# EAGLE design ERA-3SM (EAGLE 6.5.0)
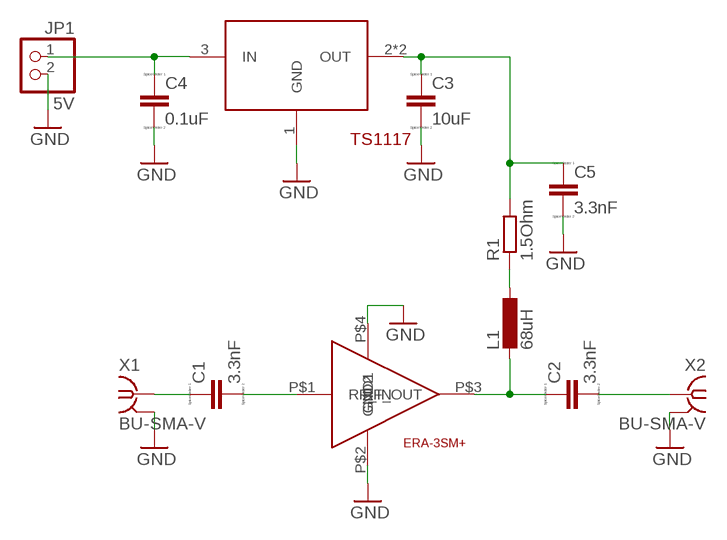
[diagram p0: schematic, sheet 1]

## Parts
C1  3.3nF  C_SMD  [C0805]
C2  3.3nF  C_SMD  [C0805]
C3  10uF  C_SMD  [C0805]
C4  0.1uF  C_SMD  [C0805]
C5  3.3nF  C_SMD  [C0805]
JP1  5V  PINHD-1X2  [1X02]
L1  68uH  L-EU  [1616FPS]
R1  1.5Ohm  R-EU_R0805  [R0805]
U$1  ERA-3SM+  [WW107]
U$2  TS1117  [SOT223]
X1  BU-SMA-V  [BU-SMA-V]
X2  BU-SMA-V  [BU-SMA-V]

## Nets
GND: C3.2 C4.2 C5.2 JP1.2 U$1.P$2(GND1) U$1.P$4(GND2) U$2.1(GND) X1.2 X1.3 X1.4 X1.5 X2.2 X2.3 X2.4 X2.5
N$1: C1.1 X1.1
N$2: C1.2 U$1.P$1(RF_IN)
N$3: C2.1 L1.P$2 U$1.P$3(RF_OUT)
N$4: C2.2 X2.1
N$5: L1.P$1 R1.1
N$6: C3.1 C5.1 R1.2 U$2.2(OUT) U$2.4(OUT)
N$7: C4.1 JP1.1 U$2.3(IN)

## Library data of the parts
C1-C5 = 0myLib:C_SMD: CAPACITOR, European symbol; SPICEMODEL: NONE; SPICEPREFIX: C
JP1 = 0myLib:PINHD-1X2: PIN HEADER
L1 = 0myLib:L-EU: INDUCTOR, European symbol
R1 = 0myLib:R-EU_: RESISTOR, European symbol
U$1 = 0myLib:ERA-3SM+
U$2 = 0myLib:TS1117
X1 X2 = 0myLib:BU-SMA-V: FEMALE SMA CONNECTOR Radiall distributor RS 112-3794; OC_FARNELL: unknown; OC_NEWARK: unknown

## Board
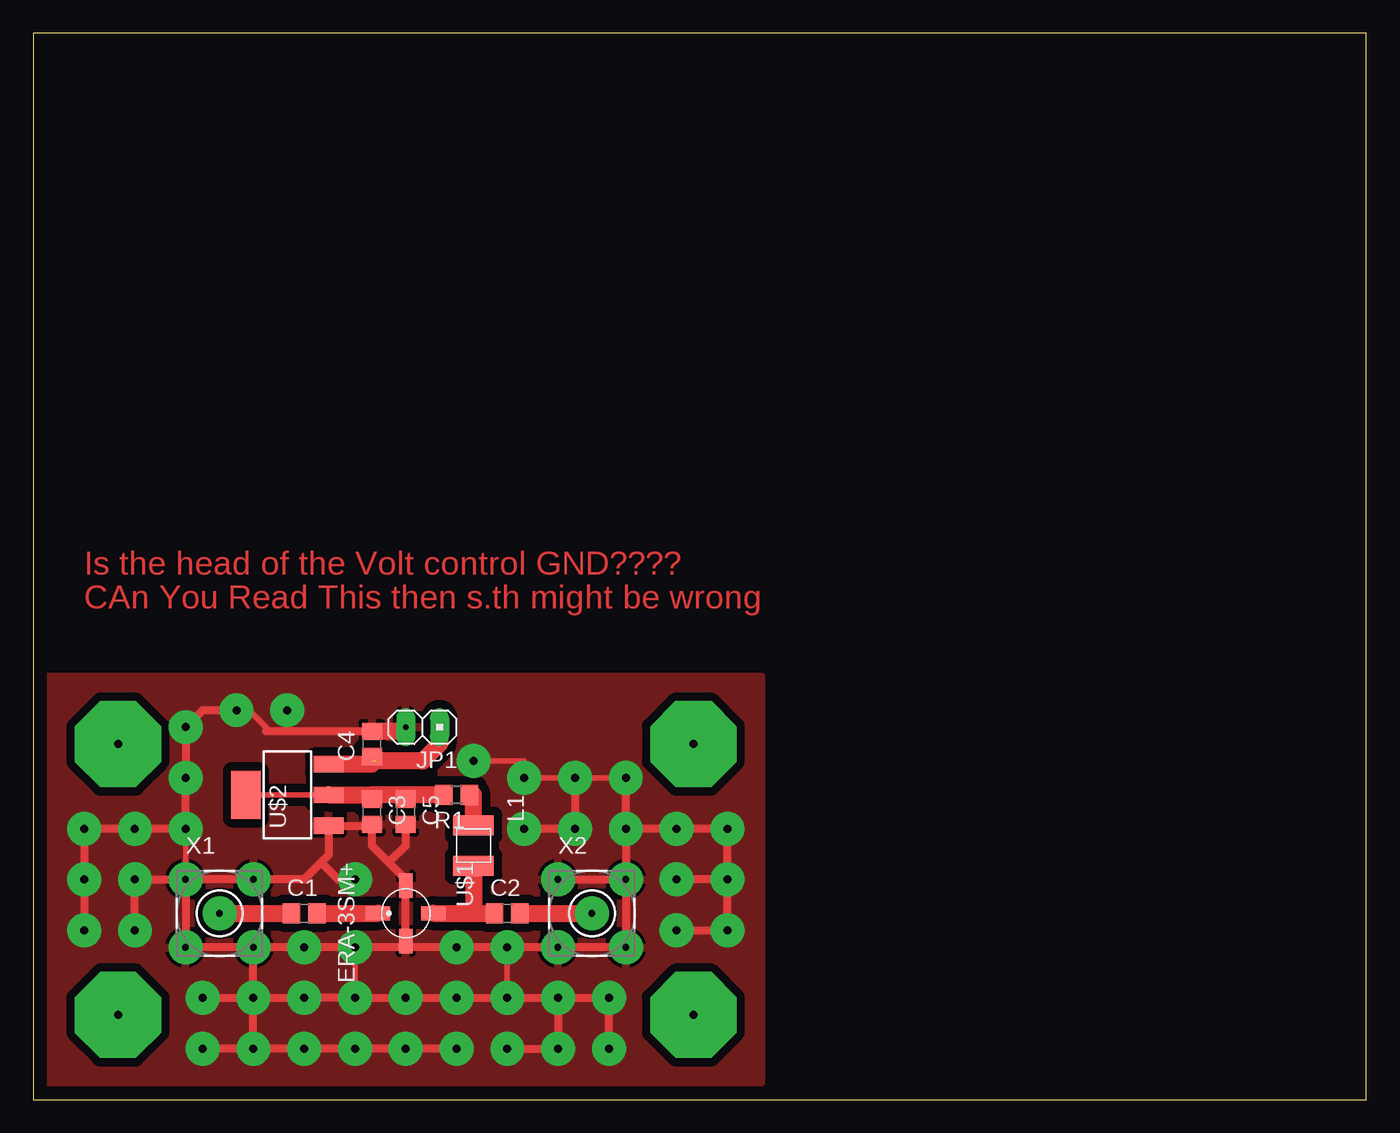
[diagram p1: board, top side]
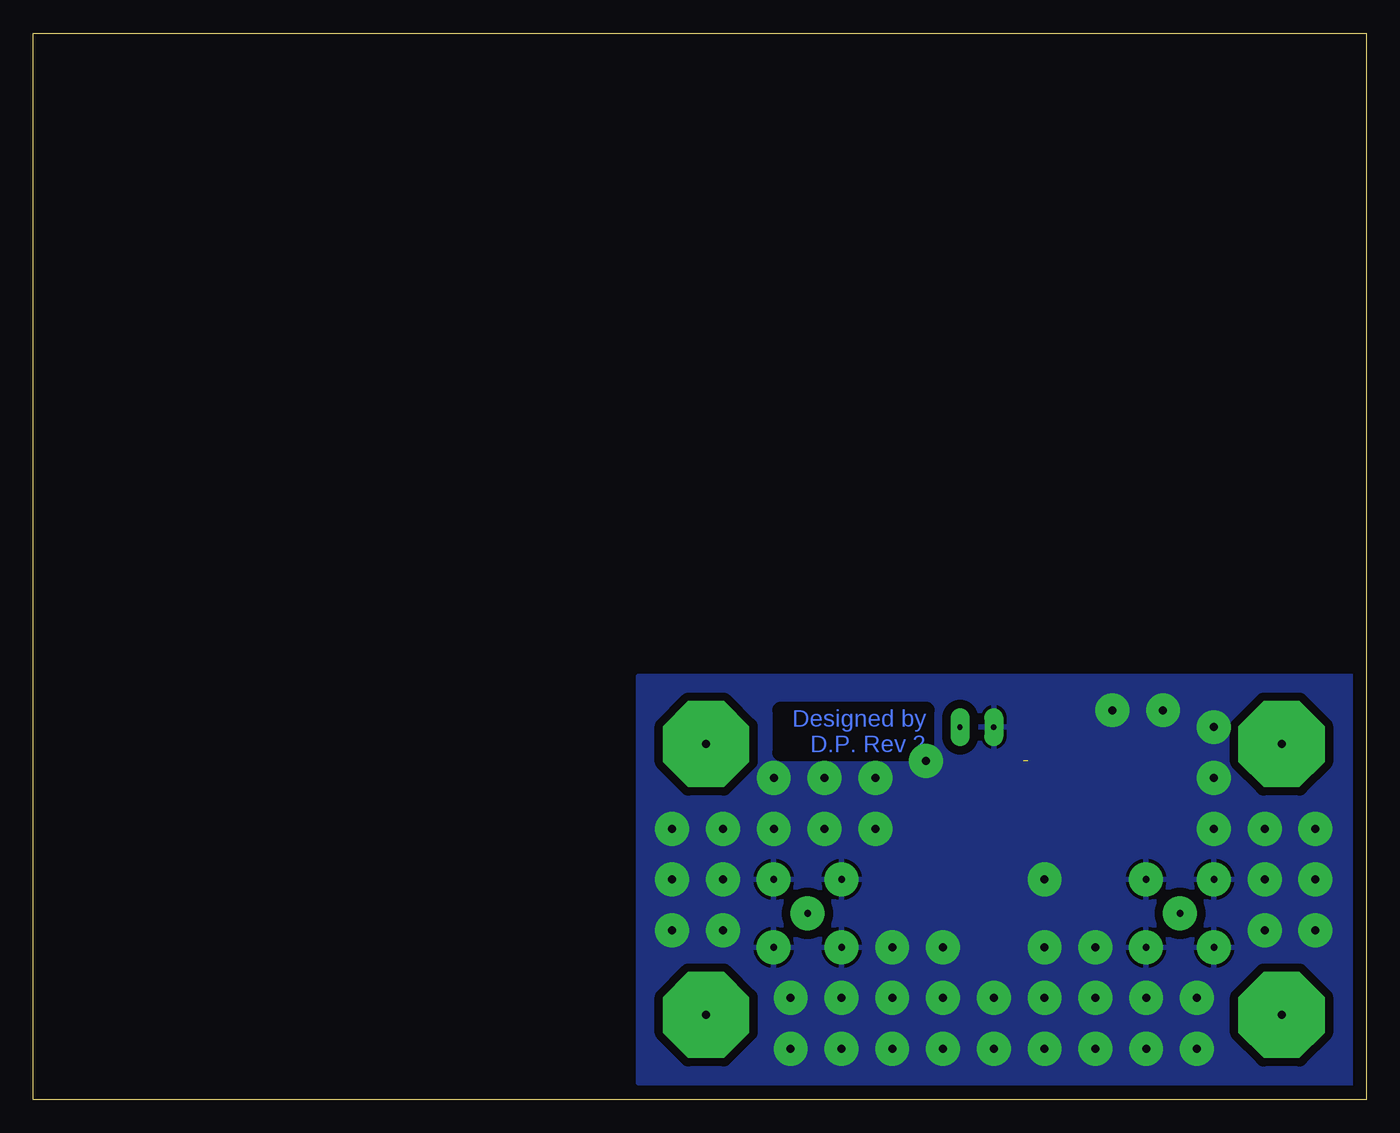
[diagram p2: board, bottom side, seen from below]

Size 100 x 80 mm. Coordinates in mm from the lower left corner, seen from the top.
Outline: 0,0 100,0 100,80 0,80 0,0
Copper layers (1*16): Top 0.035mm / dielectric 1.5mm / Bottom 0.035mm
Design rules "FinalizeAreaFill": minimum track width 12mil, minimum drill 1.4mm, track to track 25mil, track to pad 25mil, pad to pad 8mil, via to via 8mil, smd to smd 8mil, copper to edge 40mil, drill to drill 8mil, minimum pad ring 10mil, minimum via ring 8mil, stop-mask expansion 4mil, vias tented up to drill 0mil, thermal gap 10mil

### Footprints (pad centres in the part's own frame; a part is rotated, then mirrored left to right if it is on the bottom)
C0805 = smd 1.3 x 1.5: 1 -0.95,0; 2 0.95,0
1X02 = drill 0.4 pad 1.422 long: 1 -1.27,0; 2 1.27,0
1616FPS = smd 1.524 x 3.048: P$1 -1.524,0; P$2 1.524,0
R0805 = smd 1.3 x 1.5: 1 -0.95,0; 2 0.95,0
WW107 = smd 1.016 x 1.829: P$1 0,-2.07; P$3 0,2.07 | smd 1.829 x 1.016: P$2 2.07,0; P$4 -2.07,0
SOT223 = smd 1.219 x 2.235: 1 -2.311,-3.099; 2 0,-3.099; 3 2.311,-3.099 | smd 3.6 x 2.2: 4 0,3.099
BU-SMA-V = drill 0.5 pad 2.54: 1 0,0; 2 -2.55,2.55; 3 2.55,2.55; 4 2.55,-2.55; 5 -2.55,-2.55

### Placement (x,y rotation side)
C1  20.32,13.97 0 top
C2  35.56,13.97 0 top
C3  25.4,21.59 270 top
C4  25.4,26.67 90 top
C5  27.94,21.59 270 top
JP1  29.21,27.94 180 top
L1  33.02,19.05 270 top
R1  31.75,22.86 180 top
U$1  27.94,13.97 270 top
U$2  19.05,22.86 90 top
X1  13.97,13.97 0 top
X2  41.91,13.97 0 top

### Tracks (layer width: path | path; a pad name or v marks a point on that pad's centre or on a via)
GND  (via drill 0.6 pad 2.54)
  Top 0.406: v15.24,29.21 16.19,29.21 17.78,27.62 | X1.4 v20.32,11.42 v20.32,11.43 | v24.13,11.43 v24.13,7.62 | v31.75,11.43 v35.56,11.43 v35.56,7.62 | v33.02,25.4 36.83,25.4 v36.83,24.13 v40.64,24.13 v44.45,24.13 | v19.05,29.21 19.05,27.62 | X1.2 v11.43,20.32
  Top 0.61: X1.2 X1.3 20.32,16.51 21.59,17.78 | X1.2 X1.5 X1.4 | 21.59,17.78 22.15,18.34 U$2.1 25.31,20.55 C3.2 25.4,19.05 26.67,17.78 | 26.67,17.78 27.94,16.51 U$1.P$4 U$1.P$2 | C4.2 19.05,27.62 17.78,27.62 17.46,27.62 | X2.2 X2.3 | X2.3 X2.4 X2.5 X1.4 | v12.7,7.62 v16.51,7.62 | v16.51,7.62 v20.32,7.62 v24.13,7.62 v27.94,7.62 v31.75,7.62 v35.56,7.62 v39.37,7.62 | v39.37,7.62 v43.18,7.62 v43.18,3.81 | v39.37,7.62 v39.37,3.81 v35.56,3.81 | v31.75,3.81 v27.94,3.81 v24.13,3.81 v20.32,3.81 v16.51,3.81 | v16.51,3.81 v12.7,3.81 | v16.51,3.81 v16.51,7.62 | v16.51,7.62 X1.4 | v48.26,12.7 v52.07,12.7 v52.07,16.51 | v52.07,16.51 v48.26,16.51 | v52.07,16.51 v52.07,20.32 v48.26,20.32 v44.45,20.32 | v44.45,20.32 v44.45,24.13 | v40.64,24.13 v40.64,20.32 v36.83,20.32 | v44.45,20.32 X2.3 | v24.13,16.51 22.86,16.51 21.59,17.78 | v15.24,29.21 12.7,29.21 v11.43,27.94 v11.43,24.13 v11.43,20.32 v7.62,20.32 v3.81,20.32 v3.81,16.51 v3.81,12.7 | v7.62,12.7 v7.62,16.51 X1.2 | C5.2 27.94,19.05 26.67,17.78
  Top 1.27: JP1.2 27.62,27.62 C4.2
  pour Bottom: 0,31.75 0,1.27 54.61,1.27 54.61,31.75
  pour Top: 0,1.27 0,31.75 54.61,31.75 54.61,1.27
N$1
  Top 1.27: X1.1 C1.1
N$2
  Top 1.27: C1.2 U$1.P$1
N$3
  Top 1.27: U$1.P$3 33.02,13.97 | 33.02,13.97 C2.1 | L1.P$2 33.02,13.97
N$4
  Top 1.27: C2.2 X2.1
N$5
  Top 1.27: L1.P$1 33.02,22.86 R1.1
N$6
  Top 0.406: U$2.2 U$2.4
  Top 1.27: R1.2 27.94,22.86 | 27.94,22.86 25.4,22.86 | U$2.2 25.4,22.86 | 25.4,22.86 C3.1 | C5.1 27.94,22.86
N$7  (1 unrouted)
  Top 1.27: U$2.3 25.4,25.17 25.4,25.4 | JP1.1 30.48,26.67 29.21,25.4 25.72,25.4 C4.1
N$8  (via drill 0.6 pad 6.45)
  other vias: 6.35,6.35
N$9  (via drill 0.6 pad 6.45)
  other vias: 49.53,6.35
N$11  (via drill 0.6 pad 6.45)
  other vias: 6.35,26.67
N$12  (via drill 0.6 pad 6.45)
  other vias: 49.53,26.67

### Text on the board
Top: Is the head of the Volt control GND???? | CAn You Read This then s.th might be wrong
Bottom: Designed by / D.P. Rev 2